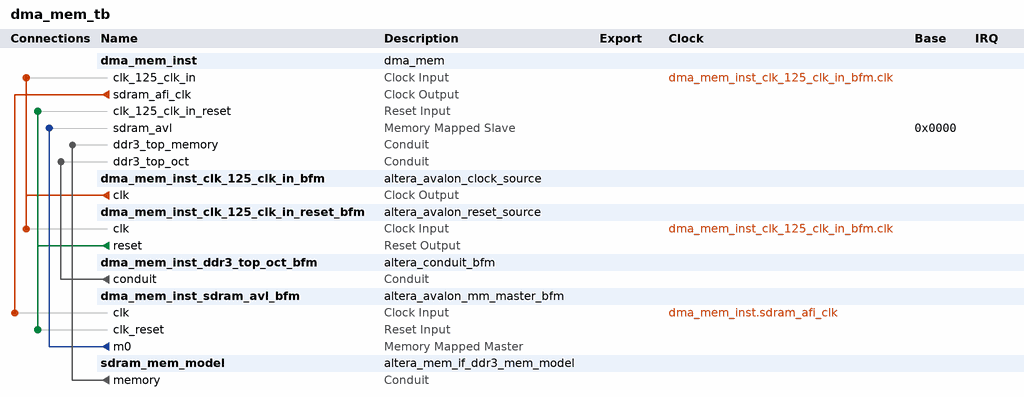
[diagram p0: system contents]
# Platform Designer (Qsys) system dma_mem_tb, Cyclone V 5CGTFD9E5F35C7
# Parameters at their usual value, and those the tool derives, are not listed.
package require -exact qsys 14.1
create_system dma_mem_tb
set_project_property DEVICE_FAMILY {Cyclone V}
set_project_property DEVICE 5CGTFD9E5F35C7

add_instance dma_mem_inst dma_mem 1.0

add_instance dma_mem_inst_clk_125_clk_in_bfm altera_avalon_clock_source 14.1
set_instance_parameter_value dma_mem_inst_clk_125_clk_in_bfm CLOCK_RATE 125000000

add_instance dma_mem_inst_clk_125_clk_in_reset_bfm altera_avalon_reset_source 14.1
set_instance_parameter_value dma_mem_inst_clk_125_clk_in_reset_bfm ASSERT_HIGH_RESET 0
set_instance_parameter_value dma_mem_inst_clk_125_clk_in_reset_bfm INITIAL_RESET_CYCLES 50

add_instance dma_mem_inst_ddr3_top_oct_bfm altera_conduit_bfm 14.1
set_instance_parameter_value dma_mem_inst_ddr3_top_oct_bfm CLOCKED_SIGNAL false
set_instance_parameter_value dma_mem_inst_ddr3_top_oct_bfm ENABLE_RESET false
set_instance_parameter_value dma_mem_inst_ddr3_top_oct_bfm SIGNAL_DIRECTIONS output
set_instance_parameter_value dma_mem_inst_ddr3_top_oct_bfm SIGNAL_ROLES rzqin
set_instance_parameter_value dma_mem_inst_ddr3_top_oct_bfm SIGNAL_WIDTHS 1

add_instance dma_mem_inst_sdram_avl_bfm altera_avalon_mm_master_bfm 14.1
set_instance_parameter_value dma_mem_inst_sdram_avl_bfm ADDRESS_UNITS WORDS
set_instance_parameter_value dma_mem_inst_sdram_avl_bfm AV_ADDRESS_W 25
set_instance_parameter_value dma_mem_inst_sdram_avl_bfm AV_ALWAYS_BURST_MAX_BURST 0
set_instance_parameter_value dma_mem_inst_sdram_avl_bfm AV_BURSTCOUNT_W 9
set_instance_parameter_value dma_mem_inst_sdram_avl_bfm AV_BURST_BNDR_ONLY 0
set_instance_parameter_value dma_mem_inst_sdram_avl_bfm AV_BURST_LINEWRAP 0
set_instance_parameter_value dma_mem_inst_sdram_avl_bfm AV_CONSTANT_BURST_BEHAVIOR 1
set_instance_parameter_value dma_mem_inst_sdram_avl_bfm AV_FIX_READ_LATENCY 0
set_instance_parameter_value dma_mem_inst_sdram_avl_bfm AV_MAX_PENDING_READS 32
set_instance_parameter_value dma_mem_inst_sdram_avl_bfm AV_MAX_PENDING_WRITES 0
set_instance_parameter_value dma_mem_inst_sdram_avl_bfm AV_NUMSYMBOLS 32
set_instance_parameter_value dma_mem_inst_sdram_avl_bfm AV_READRESPONSE_W 1
set_instance_parameter_value dma_mem_inst_sdram_avl_bfm AV_READ_WAIT_TIME 1
set_instance_parameter_value dma_mem_inst_sdram_avl_bfm AV_WRITERESPONSE_W 1
set_instance_parameter_value dma_mem_inst_sdram_avl_bfm USE_BEGIN_BURST_TRANSFER 1
set_instance_parameter_value dma_mem_inst_sdram_avl_bfm USE_BURSTCOUNT 1
set_instance_parameter_value dma_mem_inst_sdram_avl_bfm USE_BYTE_ENABLE 0
set_instance_parameter_value dma_mem_inst_sdram_avl_bfm USE_READ 1
set_instance_parameter_value dma_mem_inst_sdram_avl_bfm USE_READ_DATA 1
set_instance_parameter_value dma_mem_inst_sdram_avl_bfm USE_READ_DATA_VALID 1
set_instance_parameter_value dma_mem_inst_sdram_avl_bfm USE_WAIT_REQUEST 1
set_instance_parameter_value dma_mem_inst_sdram_avl_bfm VHDL_ID 0

add_instance sdram_mem_model altera_mem_if_ddr3_mem_model 14.1
set_instance_parameter_value sdram_mem_model ALTMEMPHY_COMPATIBLE_MODE false
set_instance_parameter_value sdram_mem_model AP_MODE false
set_instance_parameter_value sdram_mem_model AP_MODE_EN 0
set_instance_parameter_value sdram_mem_model CFG_TCCD_NS 2.5
set_instance_parameter_value sdram_mem_model CUT_NEW_FAMILY_TIMING true
set_instance_parameter_value sdram_mem_model DAT_DATA_WIDTH 32
set_instance_parameter_value sdram_mem_model DEVICE_DEPTH 1
set_instance_parameter_value sdram_mem_model DISABLE_CHILD_MESSAGING false
set_instance_parameter_value sdram_mem_model DISCRETE_FLY_BY true
set_instance_parameter_value sdram_mem_model DUPLICATE_AC false
set_instance_parameter_value sdram_mem_model FORCE_DQS_TRACKING AUTO
set_instance_parameter_value sdram_mem_model FORCE_SHADOW_REGS AUTO
set_instance_parameter_value sdram_mem_model HARD_EMIF false
set_instance_parameter_value sdram_mem_model HHP_HPS false
set_instance_parameter_value sdram_mem_model HHP_HPS_SIMULATION false
set_instance_parameter_value sdram_mem_model HHP_HPS_VERIFICATION false
set_instance_parameter_value sdram_mem_model HPS_PROTOCOL DEFAULT
set_instance_parameter_value sdram_mem_model IS_ES_DEVICE false
set_instance_parameter_value sdram_mem_model LRDIMM_EXTENDED_CONFIG 0x000000000000000000
set_instance_parameter_value sdram_mem_model MEM_ASR Manual
set_instance_parameter_value sdram_mem_model MEM_ATCL Disabled
set_instance_parameter_value sdram_mem_model MEM_AUTO_LEVELING_MODE true
set_instance_parameter_value sdram_mem_model MEM_BANKADDR_WIDTH 3
set_instance_parameter_value sdram_mem_model MEM_BL OTF
set_instance_parameter_value sdram_mem_model MEM_BT Sequential
set_instance_parameter_value sdram_mem_model MEM_CK_WIDTH 1
set_instance_parameter_value sdram_mem_model MEM_CLK_EN_WIDTH 1
set_instance_parameter_value sdram_mem_model MEM_CLK_FREQ 300.0
set_instance_parameter_value sdram_mem_model MEM_CLK_FREQ_MAX 533.333
set_instance_parameter_value sdram_mem_model MEM_COL_ADDR_WIDTH 10
set_instance_parameter_value sdram_mem_model MEM_CS_WIDTH 1
set_instance_parameter_value sdram_mem_model MEM_DLL_EN true
set_instance_parameter_value sdram_mem_model MEM_DQ_PER_DQS 8
set_instance_parameter_value sdram_mem_model MEM_DQ_WIDTH 64
set_instance_parameter_value sdram_mem_model MEM_DRV_STR RZQ/6
set_instance_parameter_value sdram_mem_model MEM_FORMAT DISCRETE
set_instance_parameter_value sdram_mem_model MEM_GUARANTEED_WRITE_INIT false
set_instance_parameter_value sdram_mem_model MEM_IF_BOARD_BASE_DELAY 10
set_instance_parameter_value sdram_mem_model MEM_IF_DM_PINS_EN true
set_instance_parameter_value sdram_mem_model MEM_IF_DQSN_EN true
set_instance_parameter_value sdram_mem_model MEM_IF_SIM_VALID_WINDOW 0
set_instance_parameter_value sdram_mem_model MEM_INIT_EN false
set_instance_parameter_value sdram_mem_model MEM_MIRROR_ADDRESSING 0
set_instance_parameter_value sdram_mem_model MEM_NUMBER_OF_DIMMS 1
set_instance_parameter_value sdram_mem_model MEM_NUMBER_OF_RANKS_PER_DEVICE 1
set_instance_parameter_value sdram_mem_model MEM_NUMBER_OF_RANKS_PER_DIMM 1
set_instance_parameter_value sdram_mem_model MEM_PD {DLL off}
set_instance_parameter_value sdram_mem_model MEM_RANK_MULTIPLICATION_FACTOR 1
set_instance_parameter_value sdram_mem_model MEM_ROW_ADDR_WIDTH 14
set_instance_parameter_value sdram_mem_model MEM_RTT_NOM RZQ/4
set_instance_parameter_value sdram_mem_model MEM_RTT_WR {Dynamic ODT off}
set_instance_parameter_value sdram_mem_model MEM_SRT Normal
set_instance_parameter_value sdram_mem_model MEM_TCL 6
set_instance_parameter_value sdram_mem_model MEM_TFAW_NS 45.0
set_instance_parameter_value sdram_mem_model MEM_TINIT_US 500
set_instance_parameter_value sdram_mem_model MEM_TMRD_CK 4
set_instance_parameter_value sdram_mem_model MEM_TRAS_NS 36.0
set_instance_parameter_value sdram_mem_model MEM_TRCD_NS 13.5
set_instance_parameter_value sdram_mem_model MEM_TREFI_US 7.8
set_instance_parameter_value sdram_mem_model MEM_TRFC_NS 160.0
set_instance_parameter_value sdram_mem_model MEM_TRP_NS 13.5
set_instance_parameter_value sdram_mem_model MEM_TRRD_NS 7.5
set_instance_parameter_value sdram_mem_model MEM_TRTP_NS 7.5
set_instance_parameter_value sdram_mem_model MEM_TWR_NS 15.0
set_instance_parameter_value sdram_mem_model MEM_TWTR 5
set_instance_parameter_value sdram_mem_model MEM_USER_LEVELING_MODE Leveling
set_instance_parameter_value sdram_mem_model MEM_VENDOR Micron
set_instance_parameter_value sdram_mem_model MEM_VERBOSE true
set_instance_parameter_value sdram_mem_model MEM_WTCL 5
set_instance_parameter_value sdram_mem_model MRS_MIRROR_PING_PONG_ATSO false
set_instance_parameter_value sdram_mem_model NEXTGEN true
set_instance_parameter_value sdram_mem_model PARSE_FRIENDLY_DEVICE_FAMILY_PARAM_VALID false
set_instance_parameter_value sdram_mem_model PINGPONGPHY_EN false
set_instance_parameter_value sdram_mem_model RATE Half
set_instance_parameter_value sdram_mem_model RDIMM_CONFIG 0000000000000000
set_instance_parameter_value sdram_mem_model REFRESH_BURST_VALIDATION false
set_instance_parameter_value sdram_mem_model SPEED_GRADE 7
set_instance_parameter_value sdram_mem_model TIMING_TDH 65
set_instance_parameter_value sdram_mem_model TIMING_TDQSCK 255
set_instance_parameter_value sdram_mem_model TIMING_TDQSCKDL 1200
set_instance_parameter_value sdram_mem_model TIMING_TDQSCKDM 900
set_instance_parameter_value sdram_mem_model TIMING_TDQSCKDS 450
set_instance_parameter_value sdram_mem_model TIMING_TDQSQ 125
set_instance_parameter_value sdram_mem_model TIMING_TDQSS 0.25
set_instance_parameter_value sdram_mem_model TIMING_TDS 30
set_instance_parameter_value sdram_mem_model TIMING_TDSH 0.2
set_instance_parameter_value sdram_mem_model TIMING_TDSS 0.2
set_instance_parameter_value sdram_mem_model TIMING_TIH 140
set_instance_parameter_value sdram_mem_model TIMING_TIS 190
set_instance_parameter_value sdram_mem_model TIMING_TQH 0.38
set_instance_parameter_value sdram_mem_model TIMING_TQSH 0.4
set_instance_parameter_value sdram_mem_model USE_MEM_CLK_FREQ false

# connections
add_connection dma_mem_inst.sdram_afi_clk dma_mem_inst_sdram_avl_bfm.clk clock
add_connection dma_mem_inst_clk_125_clk_in_bfm.clk dma_mem_inst.clk_125_clk_in clock
add_connection dma_mem_inst_clk_125_clk_in_bfm.clk dma_mem_inst_clk_125_clk_in_reset_bfm.clk clock
add_connection dma_mem_inst_clk_125_clk_in_reset_bfm.reset dma_mem_inst.clk_125_clk_in_reset reset
add_connection dma_mem_inst_clk_125_clk_in_reset_bfm.reset dma_mem_inst_sdram_avl_bfm.clk_reset reset
add_connection dma_mem_inst_sdram_avl_bfm.m0 dma_mem_inst.sdram_avl avalon
set_connection_parameter_value dma_mem_inst_sdram_avl_bfm.m0/dma_mem_inst.sdram_avl baseAddress 0x0000
add_connection dma_mem_inst_ddr3_top_oct_bfm.conduit dma_mem_inst.ddr3_top_oct conduit
add_connection sdram_mem_model.memory dma_mem_inst.ddr3_top_memory conduit

set_interconnect_requirement {$system} qsys_mm.clockCrossingAdapter HANDSHAKE
set_interconnect_requirement {$system} qsys_mm.insertDefaultSlave FALSE
set_interconnect_requirement {$system} qsys_mm.maxAdditionalLatency 1

save_system dma_mem_tb.qsys
